# Altium schematic sheet ADC.SchDoc
size A4
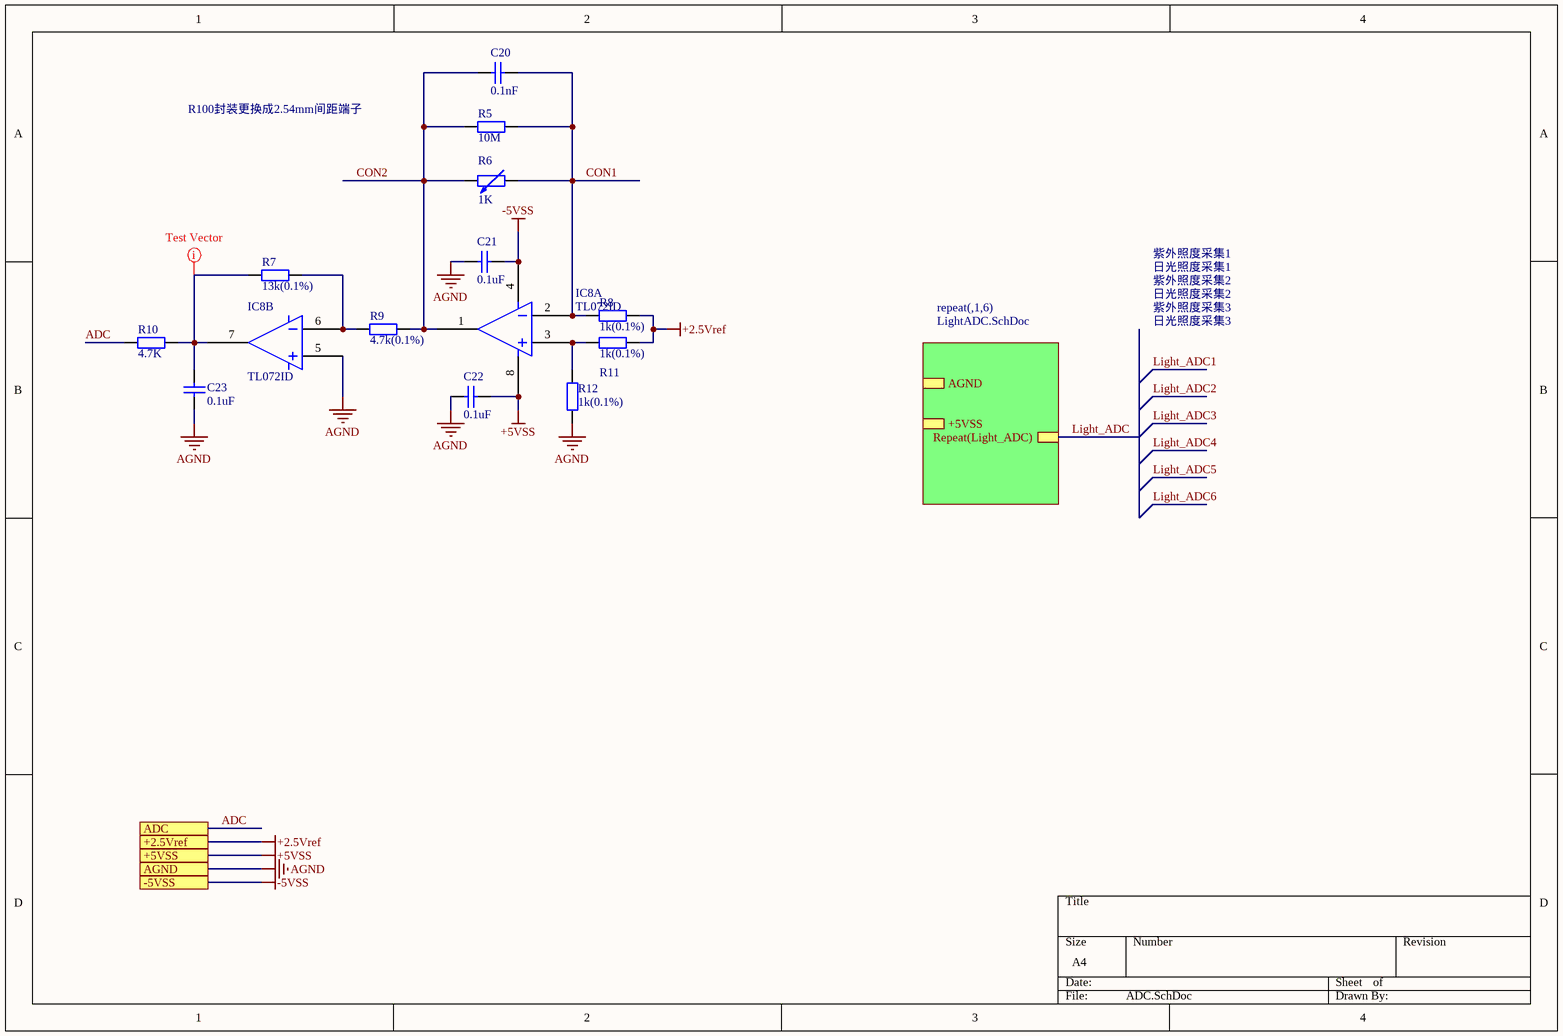
[diagram p0: ADC.SchDoc]

## Parts
C20  0.1nF  [0603C]
C21  0.1uF  [0603C]
C22  0.1uF  [0603C]
C23  0.1uF  [0603C]
IC8  TL072ID  [SOP8]  (parts A,B of 2)
R5  10M  [0603R]
R6  1K  [F-DG141V-2.54-2P]
R7  13k(0.1%)  [0603R]
R8  1k(0.1%)  [0603R]
R9  4.7k(0.1%)  [0603R]
R10  4.7K  [0603R]
R11  1k(0.1%)  [0603R]
R12  1k(0.1%)  [0603R]

## Sub-sheets
repeat(,1,6) = LightADC.SchDoc: Repeat(Light_ADC), AGND, +5VSS

## Ports
+2.5Vref, +5VSS, -5VSS, ADC, AGND

## Nets
+2.5Vref: R8.1 R11.1 ; port +2.5Vref
+5VSS: C22.2 IC8.8 ; port +5VSS
-5VSS: C21.2 IC8.4 ; port -5VSS
AGND: C21.1 C22.1 C23.1 IC8.5 R12.2 ; port AGND
ADC: R10.2 ; port ADC
CON1: C20.2 IC8.2 R5.2 R6.1 R8.2
CON2: C20.1 IC8.1 R5.1 R6.2 R9.1
Light_ADC: sheet repeat(,1,6)/Repeat(Light_ADC)
NetC23_2: C23.2 IC8.7 R7.2 R10.1
NetIC8_3: IC8.3 R11.2 R12.1
NetIC8_6: IC8.6 R7.1 R9.2

## Layout directives
Column: TestVectorIndex: NetC23_2

## Notes on the sheet
- R100封装更换成2.54mm间距端子
- 紫外照度采集1
- 日光照度采集1
- 紫外照度采集2
- 紫外照度采集3
- 日光照度采集2
- 日光照度采集3

## Library data of the parts
C20-C23 = Cap: Capacitor; Published: 8-Jun-2000; LatestRevisionDate: 17-Jul-2002; LatestRevisionNote: Re-released for DXP Platform.; PackageReference: RAD-0.3; Publisher: Altium Limited; PackageDescription: Radial Cap, Thru-Hole; 2 Leads; 0.3 in Pin Spacing
  C20: Value: 0.1nF
  C21-C23: Value: 0.1uF
IC8 = TL072_1
R5 R7-R12 = Res2: Resistor; Published: 8-Jun-2000; LatestRevisionDate: 17-Jul-2002; LatestRevisionNote: Re-released for DXP Platform.; PackageReference: AXIAL-0.4; Publisher: Altium Limited; PackageDescription: Axial Device, Thru-Hole; 2 Leads; 0.4 in Pin Spacing
  R5: Value: 10M
  R7: Value: 13k(0.1%)
  R8 R11 R12: Value: 1k(0.1%)
  R9: Value: 4.7k(0.1%)
  R10: Value: 4.7K
R6 = Res Adj2: DG141V-2.54-2P; Set Position: 0.5; Published: 8-Jun-2000; LatestRevisionDate: 17-Jul-2002; LatestRevisionNote: Re-released for DXP Platform.; PackageReference: AXIAL-0.6; Publisher: Altium Limited; PackageDescription: Axial Device, Thru-Hole; 2 Leads; 0.6 in Pin Spacing; Value: 1K